# Altium project xv11_board.PrjPcb
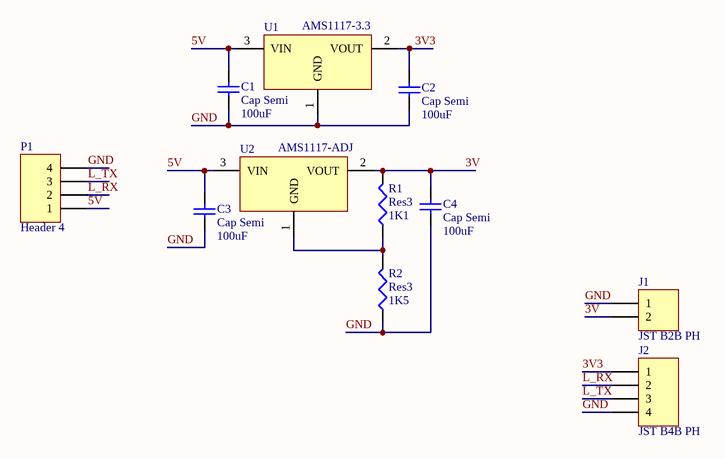
[diagram p0: xv11_board.SchDoc]
1 sheet, 11 parts. Net scope: global (net labels, ports and power ports of the same name join across sheets).
Board file: xv11_board.PcbDoc

## Sheet xv11_board.SchDoc
size A4

### Parts
C1  Cap Semi  value 100uF  [C1206]
C2  Cap Semi  value 100uF  [C1206]
C3  Cap Semi  value 100uF  [C1206]
C4  Cap Semi  value 100uF  [C1206]
J1  JST B2B PH  [JST B2B-PH-K]
J2  JST B4B PH  [JST B4B-PH-K]
P1  Header 4  [HDR1X4]
R1  Res3  value 1K1  [J1-0603]
R2  Res3  value 1K5  [J1-0603]
U1  AMS1117-3.3  [SOT-223]
U2  AMS1117-ADJ  [SOT-223]

### Nets
3V: C4.2 J1.2 R1.2 U2.2(VOUT)
3V3: C2.2 J2.1 U1.2(VOUT)
5V: C1.2 C3.2 P1.1 U1.3(VIN) U2.3(VIN)
GND: C1.1 C2.1 C3.1 C4.1 J1.1 J2.4 P1.4 R2.1 U1.1(GND)
L_RX: J2.2 P1.2
L_TX: J2.3 P1.3
NetR1_1: R1.1 R2.2 U2.1(GND)

### Library data of the parts
C1-C4 = Cap Semi: Capacitor (Semiconductor SIM Model); Published: 8-Jun-2000; LatestRevisionDate: 29-May-2009; LatestRevisionNote: IPC-7351 Footprint Added.; PackageReference: C1206; Publisher: Altium Limited; PackageDescription: Chip Capacitor
J1 = JST B2B PH: JST PH Header, 2-Pin
J2 = JST B4B PH: JST PH Header, 4-Pin
P1 = Header 4: Header, 4-Pin; LatestRevisionDate: 17-Jul-2002; LatestRevisionNote: Re-released for DXP Platform.; Publisher: Altium Limited
R1 R2 = Res3: Resistor; Published: 8-Jun-2000; LatestRevisionDate: 29-May-2009; LatestRevisionNote: IPC-7351 Footprint Added.; PackageReference: J1-0603; Publisher: Altium Limited; PackageDescription: Chip Resistor
U1 U2 = AMS1117-3.3: 3.3V  3-Terminal Adjustable Positive Voltage Regulator